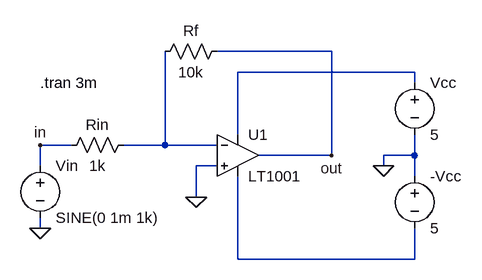
[diagram p0: schematic inverting_amp.asc]
inverting_amp.asc, the LTspice schematic file:
Version 4.1
SHEET 1 880 680
WIRE 320 0 144 0
WIRE 448 32 176 32
WIRE 448 48 448 32
WIRE 176 128 176 32
WIRE -80 144 -128 144
WIRE 64 144 64 0
WIRE 64 144 0 144
WIRE 144 144 64 144
WIRE 320 160 320 0
WIRE 320 160 208 160
WIRE 448 160 448 128
WIRE 448 160 400 160
WIRE -128 176 -128 144
WIRE 144 176 112 176
WIRE 400 176 400 160
WIRE 448 192 448 160
WIRE 112 224 112 176
WIRE -128 272 -128 256
WIRE 176 320 176 192
WIRE 448 320 448 272
WIRE 448 320 176 320
FLAG 112 224 0
FLAG -128 272 0
FLAG 400 176 0
FLAG -128 144 in
FLAG 320 160 out
SYMBOL res 16 128 R90
WINDOW 0 0 56 VBottom 2
WINDOW 3 32 56 VTop 2
SYMATTR InstName Rin
SYMATTR Value 1k
SYMBOL res 160 -16 R90
WINDOW 0 0 56 VBottom 2
WINDOW 3 32 56 VTop 2
SYMATTR InstName Rf
SYMATTR Value 10k
SYMBOL voltage -128 160 R0
WINDOW 123 0 0 Left 0
WINDOW 39 0 0 Left 0
SYMATTR InstName Vin
SYMATTR Value SINE(0 1m 1k)
SYMBOL voltage 448 32 R0
WINDOW 123 0 0 Left 0
WINDOW 39 0 0 Left 0
SYMATTR InstName Vcc
SYMATTR Value 5
SYMBOL voltage 448 176 R0
WINDOW 123 0 0 Left 0
WINDOW 39 0 0 Left 0
SYMATTR InstName -Vcc
SYMATTR Value 5
SYMBOL OpAmps\\LT1001 176 96 R0
SYMATTR InstName U1
TEXT -128 48 Left 2 !.tran 3m

The netlist it stands for:
* inverting_amp.asc
Rin N002 in 1k
Rf out N002 10k
Vin in 0 SINE(0 1m 1k)
Vcc N001 0 5
V§-Vcc 0 N003 5
X§U1 0 N002 N001 N003 out LT1001  ; pins In+ In- V+ V- OUT
.tran 3m
.lib LTC.lib
.backanno
.end